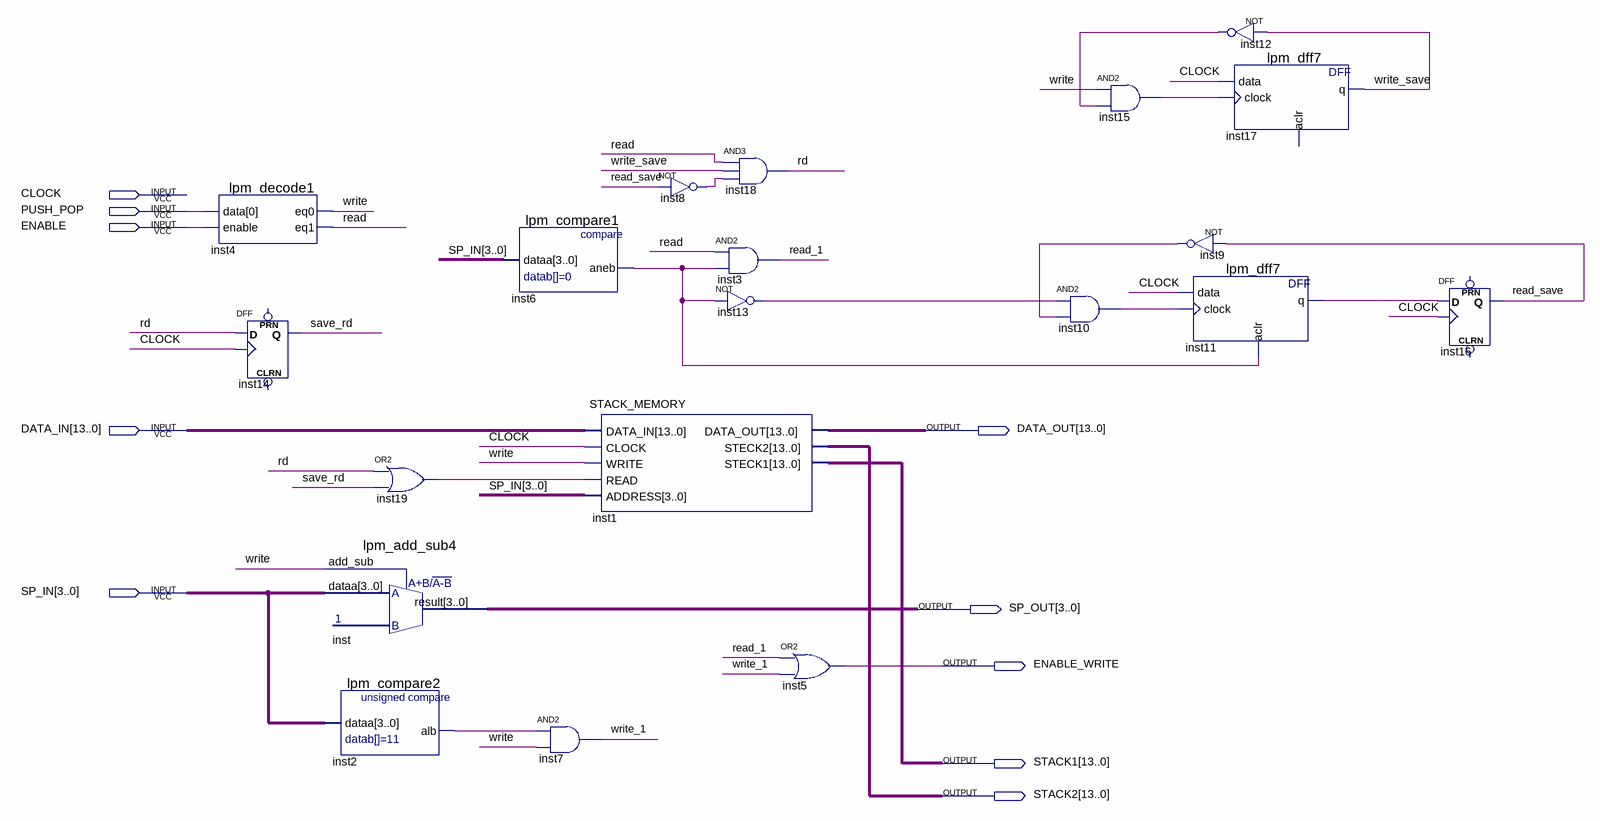
[diagram p0: schematic sheet]
// Quartus schematic STACK.bdf as structural Verilog: 20 symbols, 10 pins
module STACK (
  input  CLOCK,
  input  PUSH_POP,
  input  ENABLE,
  input  [13:0] DATA_IN,
  input  [3:0] SP_IN,
  output [13:0] DATA_OUT,
  output [3:0] SP_OUT,
  output ENABLE_WRITE,
  output [13:0] STACK1,
  output [13:0] STACK2
);

  wire inst2_alb, inst6_aneb, inst8_out, inst9_out, inst10_out, inst11_q, inst12_out, inst13_out, inst15_out,
       inst19_out, rd, read, read_1, read_save, save_rd, write, write_1, write_save;

  lpm_decode1 inst4 (.data(PUSH_POP), .enable(ENABLE), .eq0(write), .eq1(read));
  DFF inst14 (.CLK(CLOCK), .D(rd), .Q(save_rd));  // open: CLRN, PRN
  or inst19 (inst19_out, rd, save_rd);
  lpm_add_sub4 inst (.dataa(SP_IN), .add_sub(write), .result(SP_OUT));
  lpm_compare2 inst2 (.dataa(SP_IN), .alb(inst2_alb));
  lpm_compare1 inst6 (.dataa(SP_IN), .aneb(inst6_aneb));
  and inst7 (write_1, inst2_alb, write);
  STACK_MEMORY inst1 (
    .DATA_IN(DATA_IN), .CLOCK(CLOCK), .WRITE(write), .READ(inst19_out), .ADDRESS(SP_IN), .DATA_OUT(DATA_OUT),
    .STECK2(STACK2), .STECK1(STACK1));
  not inst8 (inst8_out, read_save);
  and inst18 (rd, read, write_save, inst8_out);
  and inst3 (read_1, read, inst6_aneb);
  not inst13 (inst13_out, inst6_aneb);
  or inst5 (ENABLE_WRITE, read_1, write_1);
  and inst15 (inst15_out, write, inst12_out);
  and inst10 (inst10_out, inst13_out, inst9_out);
  not inst12 (inst12_out, write_save);
  lpm_dff7 inst17 (.data(CLOCK), .clock(inst15_out), .q(write_save));  // open: aclr
  not inst9 (inst9_out, read_save);
  lpm_dff7 inst11 (.data(CLOCK), .clock(inst10_out), .aclr(inst6_aneb), .q(inst11_q));
  DFF inst16 (.CLK(CLOCK), .D(inst11_q), .Q(read_save));  // open: CLRN, PRN
endmodule
